# EAGLE design fdcanusb (EAGLE 6.5.0)
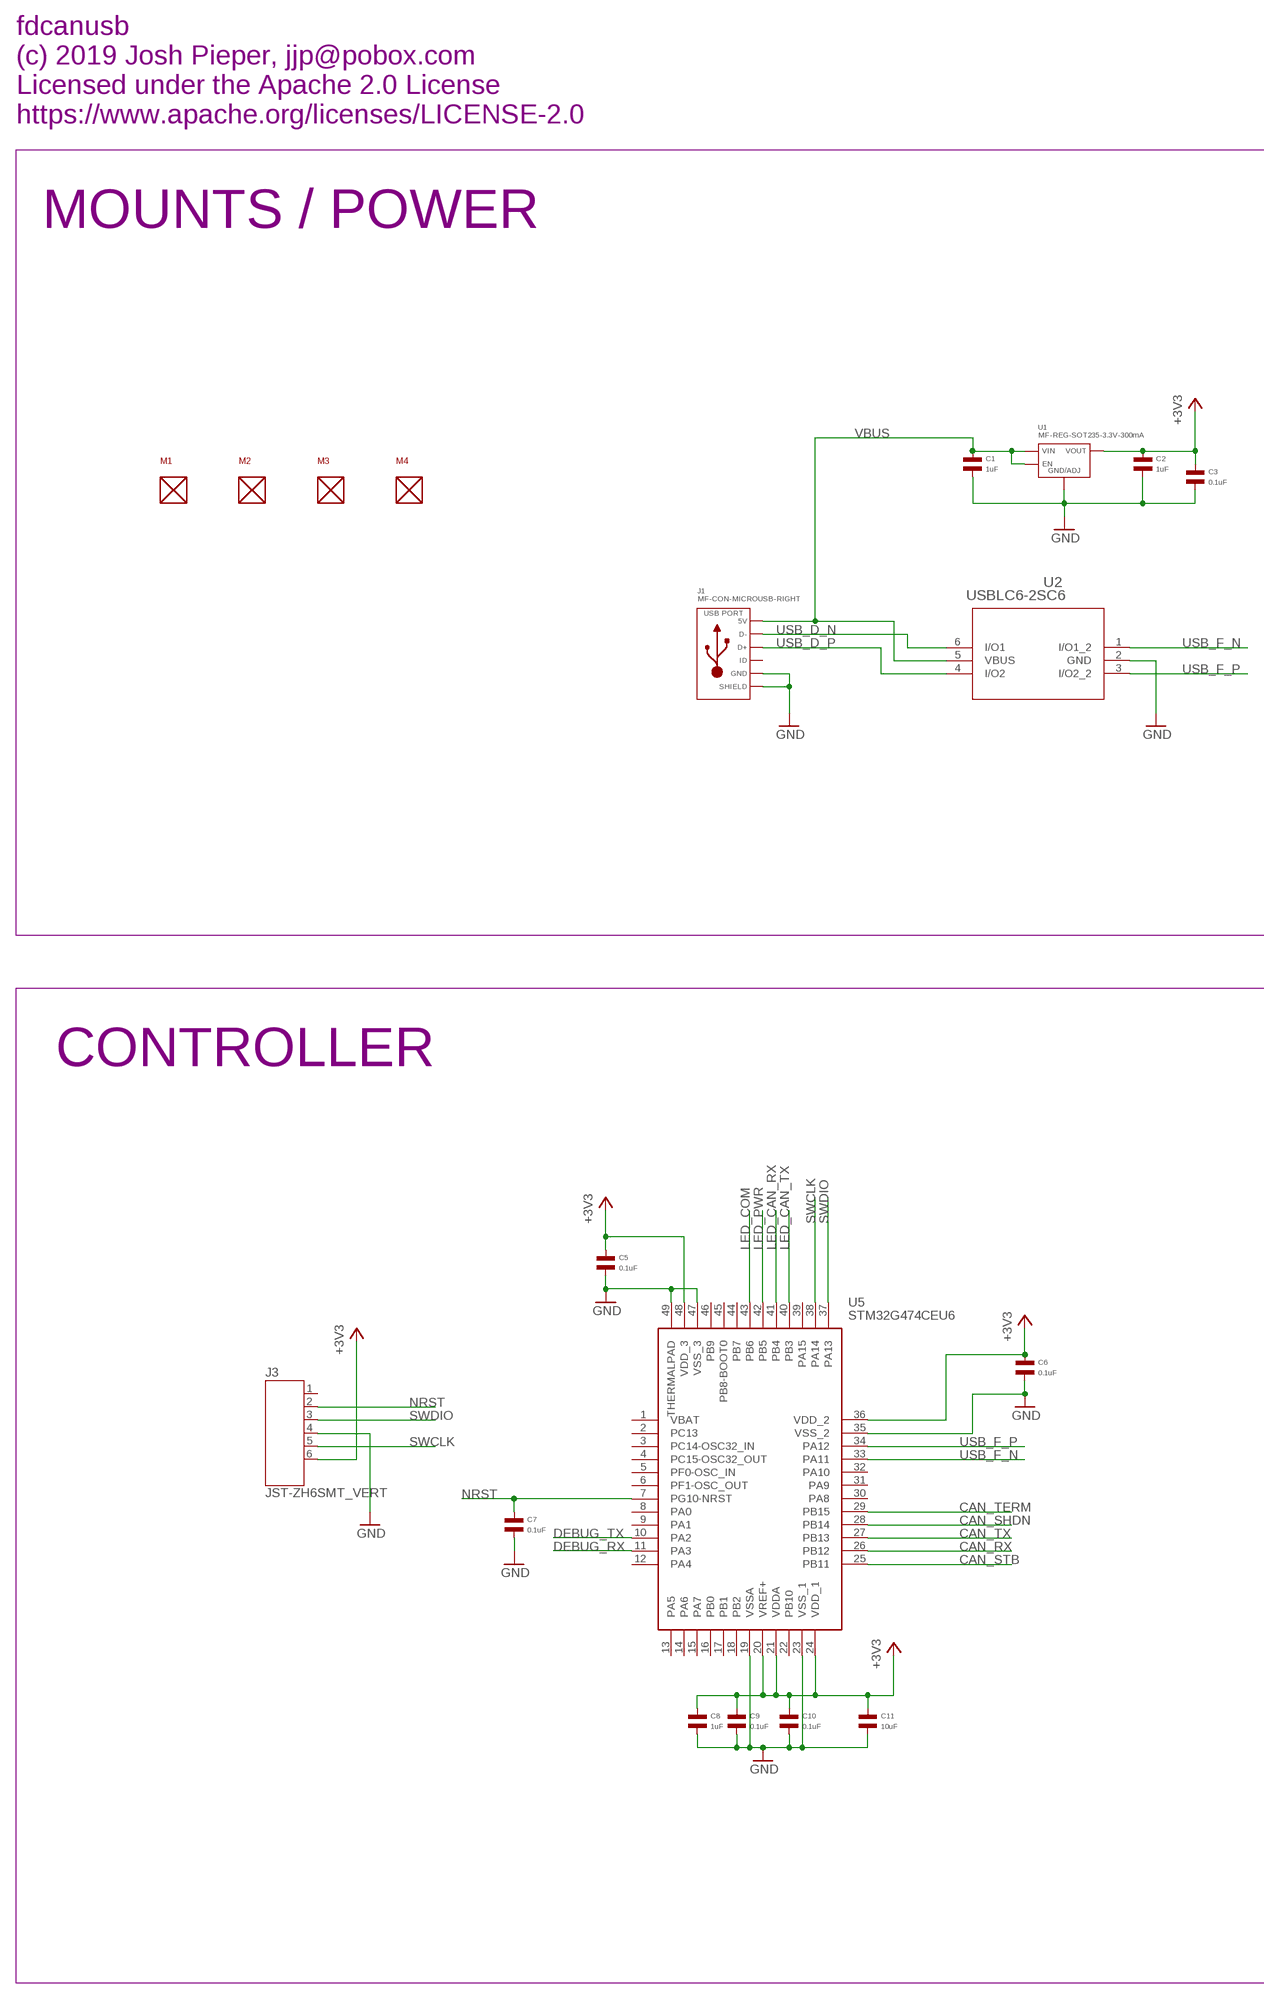
[diagram p0: schematic, sheet 1, part 1 of 2]
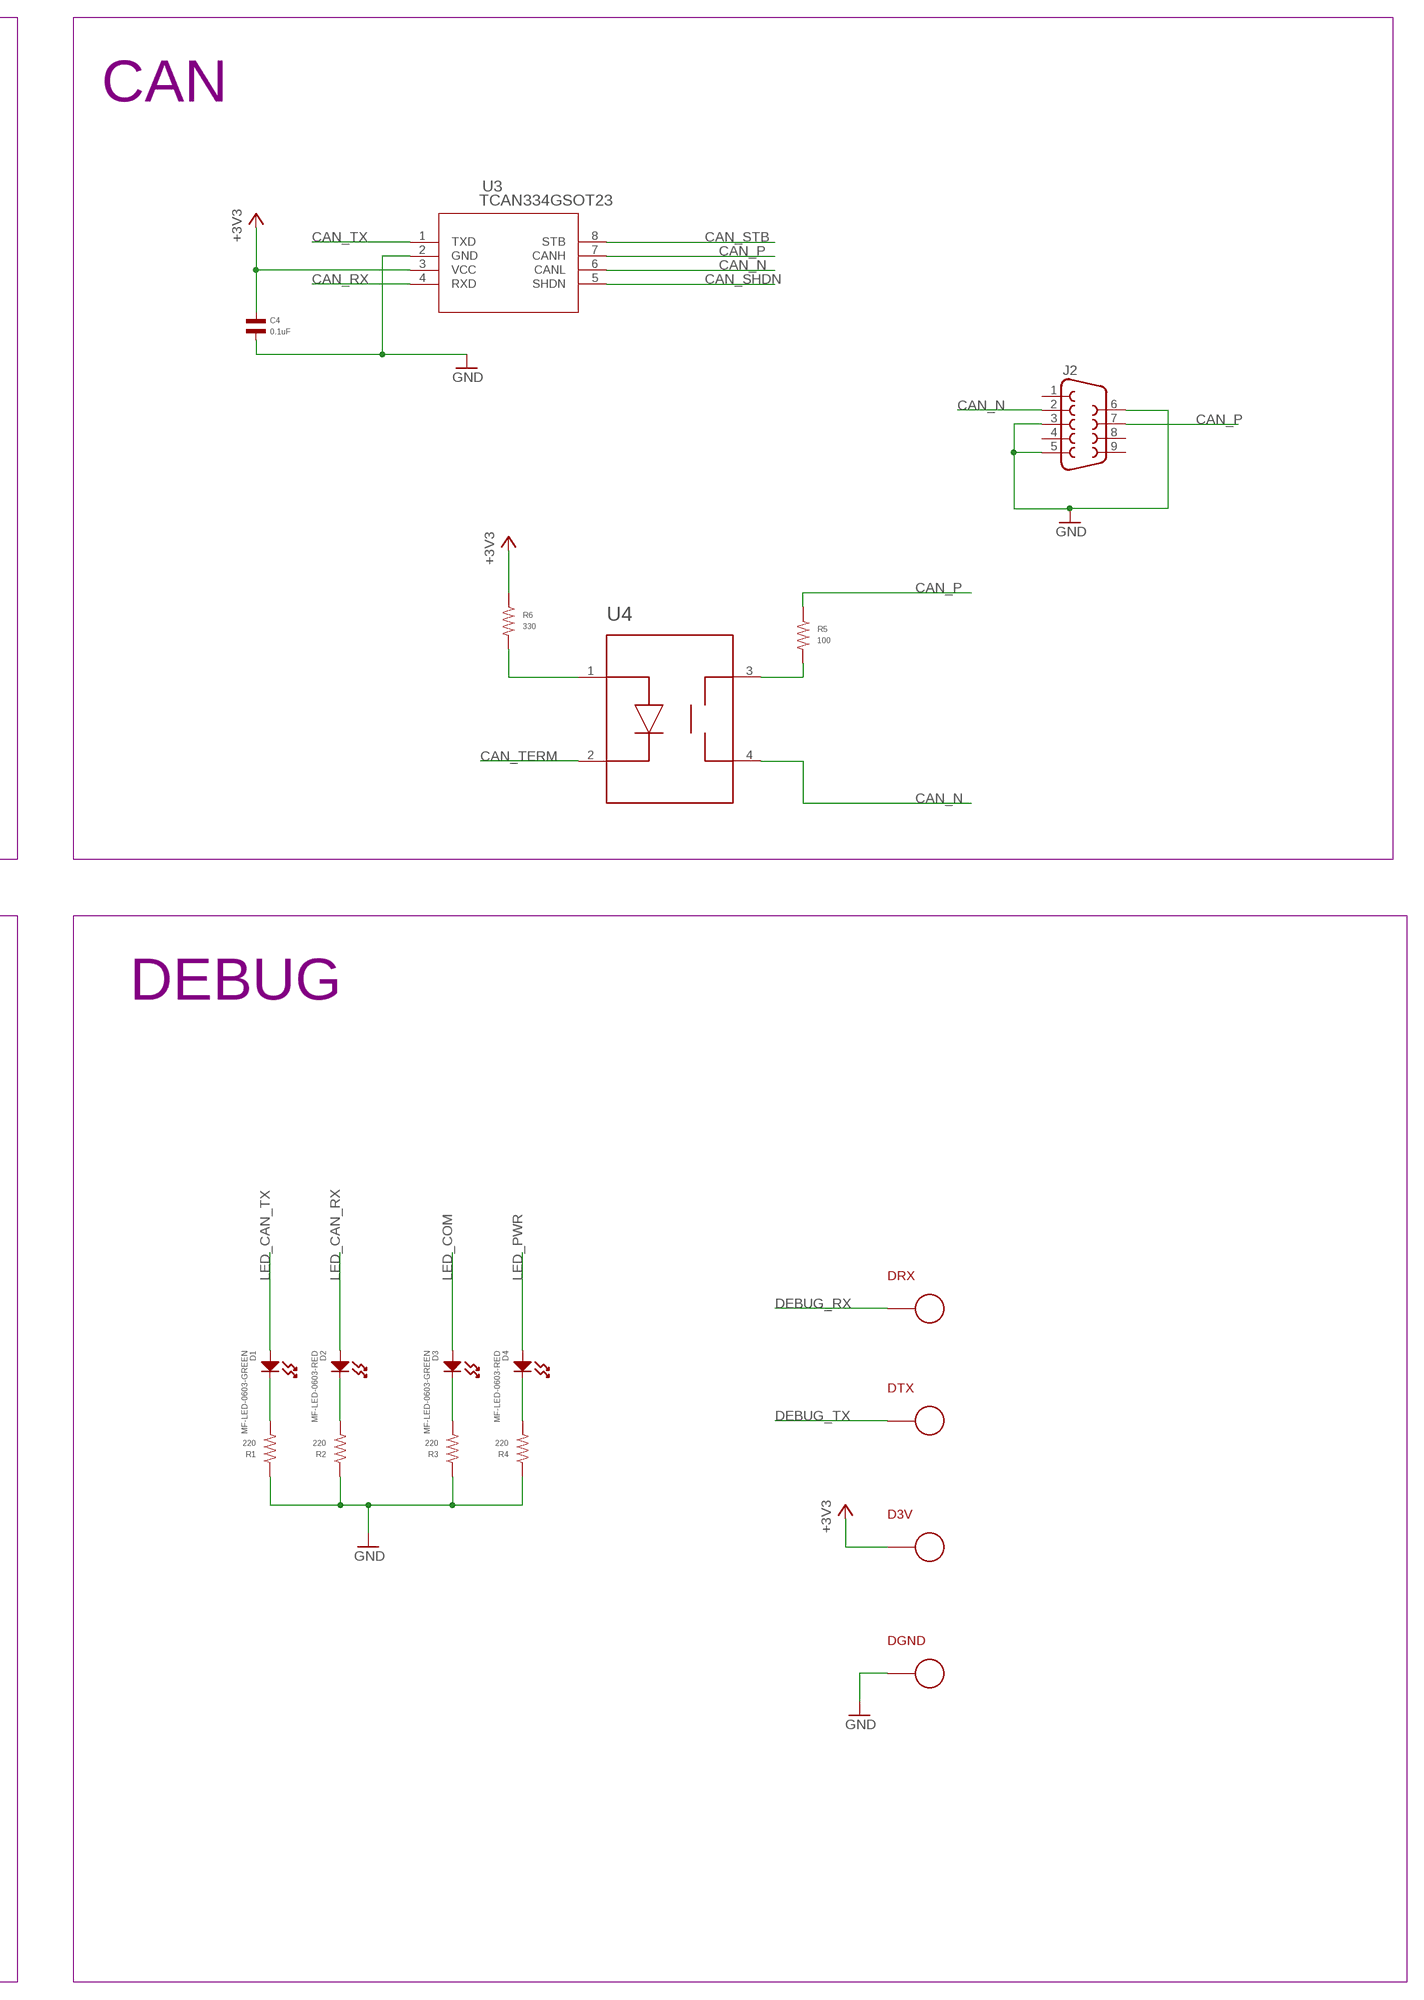
[diagram p1: schematic, sheet 1, part 2 of 2]

## Parts
C1  1uF  CAPACITOR_NP_0603  [C0603]
C2  1uF  CAPACITOR_NP_0603  [C0603]
C3  0.1uF  CAPACITOR_NP_0402  [C0402]
C4  0.1uF  CAPACITOR_NP_0402  [C0402]
C5  0.1uF  CAPACITOR_NP_0402  [C0402]
C6  0.1uF  CAPACITOR_NP_0402  [C0402]
C7  0.1uF  CAPACITOR_NP_0402  [C0402]
C8  1uF  CAPACITOR_NP_0603  [C0603]
C9  0.1uF  CAPACITOR_NP_0402  [C0402]
C10  0.1uF  CAPACITOR_NP_0402  [C0402]
C11  10uF  CAPACITOR_NP_1206  [C1206]
D1  MF-LED-0603-GREEN  LED_SINGLE-0603-GREEN  [LED0603]
D2  MF-LED-0603-RED  LED_SINGLE-0603-RED  [LED0603]
D3  MF-LED-0603-GREEN  LED_SINGLE-0603-GREEN  [LED0603]
D3V  PAD24AWG_PAD  [24AWG_PAD]
D4  MF-LED-0603-RED  LED_SINGLE-0603-RED  [LED0603]
DGND  PAD24AWG_PAD  [24AWG_PAD]
DRX  PAD24AWG_PAD  [24AWG_PAD]
DTX  PAD24AWG_PAD  [24AWG_PAD]
J1  MF-CON-MICROUSB-RIGHT  USB_MICRO_RIGHT  [MICROUSB-RIGHT]
J2  F09H  [F09H]
J3  JST-ZH6SMT_VERT  [JST_B6B-ZR-SM4-TF(LF)(SN)]
M1  MOUNT  [M2.5MOUNT]
M2  MOUNT  [M2.5MOUNT]
M3  MOUNT  [M2.5MOUNT]
M4  MOUNT  [M2.5MOUNT]
R1  220  RESISTOR_0402  [R0402]
R2  220  RESISTOR_0402  [R0402]
R3  220  RESISTOR_0402  [R0402]
R4  220  RESISTOR_0402  [R0402]
R5  100  RESISTOR_0805  [R0805]
R6  330  RESISTOR_0402  [R0402]
U1  MF-REG-SOT235-3.3V-300mA  TLV70233PDBVR  [SOT-23-5]
U2  USBLC6-2SC6  [SOT23-6L]
U3  TCAN334GSOT23  [SOT23-8]
U4  TLP3317  [TLP3317]
U5  STM32G474CEU6  [QFN50P700X700X60-49N]

## Nets
+3V3: C2.P$1 C3.P$1 C4.P$1 C5.P$1 C6.P$1 C8.P$1 C9.P$1 C10.P$1 C11.P$1 D3V.P$1 J3.6 R6.P$1 U1.P$5(VOUT) U3.3(VCC) U5.20(VREF+) U5.21(VDDA) U5.24(VDD_1) U5.36(VDD_2) U5.48(VDD_3)
CAN_N [can]: J2.2 U3.6(CANL) U4.4(SW2)
CAN_P [can]: J2.7 R5.P$1 U3.7(CANH)
CAN_RX: U3.4(RXD) U5.26(PB12)
CAN_SHDN: U3.5(SHDN) U5.28(PB14)
CAN_STB: U3.8(STB) U5.25(PB11)
CAN_TERM: U4.2(CATHODE) U5.29(PB15)
CAN_TX: U3.1(TXD) U5.27(PB13)
DEBUG_RX: DRX.P$1 U5.11(PA3)
DEBUG_TX: DTX.P$1 U5.10(PA2)
GND: C1.P$2 C2.P$2 C3.P$2 C4.P$2 C5.P$2 C6.P$2 C7.P$2 C8.P$2 C9.P$2 C10.P$2 C11.P$2 DGND.P$1 J1.5(GND) J1.S1(SLD) J1.S2(SLD) J1.S3(SLD) J1.S4(SLD) J1.S5(SLD) J1.S6(SLD) J2.3 J2.5 J2.6 J3.4 R1.P$1 R2.P$1 R3.P$1 R4.P$1 U1.P$2(GND/ADJ) U2.2(GND) U3.2(GND) U5.19(VSSA) U5.23(VSS_1) U5.35(VSS_2) U5.47(VSS_3) U5.49(THERMALPAD)
LED_CAN_RX: D2.ANODE U5.41(PB4)
LED_CAN_TX: D1.ANODE U5.40(PB3)
LED_COM: D3.ANODE U5.43(PB6)
LED_PWR: D4.ANODE U5.42(PB5)
N$3: D1.CATHODE R1.P$2
N$4: D2.CATHODE R2.P$2
N$5: D3.CATHODE R3.P$2
N$6: D4.CATHODE R4.P$2
N$7: R5.P$2 U4.3(SW1)
N$8: R6.P$2 U4.1(ANODE)
NRST: C7.P$1 J3.2 U5.7(PG10-NRST)
SWCLK: J3.5 U5.38(PA14)
SWDIO: J3.3 U5.37(PA13)
USB_D_N [usb]: J1.2(D-) U2.6(I/O1)
USB_D_P [usb]: J1.3(D+) U2.4(I/O2)
USB_F_N [usb]: U2.1(I/O1_2) U5.33(PA11)
USB_F_P [usb]: U2.3(I/O2_2) U5.34(PA12)
VBUS: C1.P$1 J1.1(5V) U1.P$1(VIN) U1.P$3(EN) U2.5(VBUS)
Unconnected: J1.4(ID) J2.1 J2.4 J2.8 J2.9 J3.1 U5.1(VBAT) U5.2(PC13) U5.3(PC14-OSC32_IN) U5.4(PC15-OSC32_OUT) U5.5(PF0-OSC_IN) U5.6(PF1-OSC_OUT) U5.8(PA0) U5.9(PA1) U5.12(PA4) U5.13(PA5) U5.14(PA6) U5.15(PA7) U5.16(PB0) U5.17(PB1) U5.18(PB2) U5.22(PB10) U5.30(PA8) U5.31(PA9) U5.32(PA10) U5.39(PA15) U5.44(PB7) U5.45(PB8-BOOT0) U5.46(PB9)

## Notes on the sheet
- fdcanusb
  (c) 2019 Josh Pieper, jjp@pobox.com
  Licensed under the Apache 2.0 License
  https://www.apache.org/licenses/LICENSE-2.0
- MOUNTS / POWER | CAN
- CONTROLLER | DEBUG

## Library data of the parts
C1 C2 C8 = mfpassives:CAPACITOR_NP: Library: MF_Passives Description: Device for Non-Polarized Capacitors. Manufacture part number (MPN) can be added via Attributes. Check https://factory.macrofab.com/parts for the house parts list.; HOUSEPART: YES; MPN: MF-CAP-0603-1uF; POPULATE: 1
C3-C7 C9 C10 = mfpassives:CAPACITOR_NP: Library: MF_Passives Description: Device for Non-Polarized Capacitors. Manufacture part number (MPN) can be added via Attributes. Check https://factory.macrofab.com/parts for the house parts list.; HOUSEPART: YES; MPN: MF-CAP-0402-0.1uF; POPULATE: 1
C11 = mfpassives:CAPACITOR_NP: Library: MF_Passives Description: Device for Non-Polarized Capacitors. Manufacture part number (MPN) can be added via Attributes. Check https://factory.macrofab.com/parts for the house parts list.; HOUSEPART: YES; MPN: MF-CAP-1206-10uF; POPULATE: 1
D1 D3 = mfleds:LED_SINGLE: Library: MF_LEDs Description: Device for Single LED Packages. Manufacture part number (MFG#) can be added via Attributes.; HOUSEPART: YES; MPN: MF-LED-0603-GREEN; POPULATE: 1; URL: https://factory.macrofab.com/part/MF-LED-0603-GREEN
D2 D4 = mfleds:LED_SINGLE: Library: MF_LEDs Description: Device for Single LED Packages. Manufacture part number (MFG#) can be added via Attributes.; HOUSEPART: YES; MPN: MF-LED-0603-RED; POPULATE: 1; URL: https://factory.macrofab.com/part/MF-LED-0603-RED
D3V DGND DRX DTX = fdcanusb:PAD; POPULATE: 0
J1 = mfconnectors:USB: Library: MF_Connectors Description: 5 Pin USB Connectors. SLD is the shield connection. Usually tied to ground through a small ferrite bead.; HOUSEPART: YES; MPN: MF-CON-MICROUSB-RIGHT; POPULATE: 1; URL: https://factory.macrofab.com/part/MF-CON-MICROUSB-RIGHT
J2 = fdcanusb:F09: SUB-D; OC_FARNELL: unknown; OC_NEWARK: unknown; POPULATE: 0
J3 = fdcanusb:JST-ZH6; MF: JST; MPN: B6B-ZR-SM4-TF(LF)(SN); POPULATE: 1
M1-M4 = fdcanusb:MOUNT; POPULATE: 0
R1-R4 = mfpassives:RESISTOR: Library: MF_Passives Description: Device for Resistors. Manufacture part number (MPN), Voltage, Tolerance, and Wattage Rating can be added via Attributes. Check https://factory.macrofab.com/parts for the house parts list.; MPN: MF-RES-0402-220; POPULATE: 1
R5 = mfpassives:RESISTOR: Library: MF_Passives Description: Device for Resistors. Manufacture part number (MPN), Voltage, Tolerance, and Wattage Rating can be added via Attributes. Check https://factory.macrofab.com/parts for the house parts list.; MPN: MF-RES-0805-100; POPULATE: 1
R6 = mfpassives:RESISTOR: Library: MF_Passives Description: Device for Resistors. Manufacture part number (MPN), Voltage, Tolerance, and Wattage Rating can be added via Attributes. Check https://factory.macrofab.com/parts for the house parts list.; MPN: MF-RES-0402-330; POPULATE: 1
U1 = mficpower:TLV702: Manufacturer Part #: TLV702 Manufacturer: Texas Instruments Description: LDO Voltage Regulators; HOUSEPART: YES; MPN: MF-REG-SOT235-3.3V-300mA; POPULATE: 1; URL: https://factory.macrofab.com/part/MF-REG-SOT235-3.3V-300mA
U2 = fdcanusb:USBLC6-2SC6; MANUFACTURER_PART_NUMBER: USBLC62SC6; MF: ST; MPN: USBLC6-2SC6; POPULATE: 1; VENDOR: STMicroelectronics
U3 = fdcanusb:TCAN334G; MF: TI; MPN: TCAN334GDCNT; POPULATE: 1
U4 = fdcanusb:TLP3317; MF: TOSHIBA; MPN: TLP3317; POPULATE: 1
U5 = fdcanusb:STM32G474CEU6: STMICROELECTRONICS - STM32G474CEU6 - MCU, 32BIT, 170MHZ, UFQFPN-48 Source: Datasheet <https://componentsearchengine.com/Datasheets/1/STM32G474CEU6.pdf>; DESCRIPTION: STMICROELECTRONICS - STM32G474CEU6 - MCU, 32BIT, 170MHZ, UFQFPN-48; HEIGHT: 0.6mm; MANUFACTURER_NAME: STMicroelectronics; MANUFACTURER_PART_NUMBER: STM32G474CEU6; MF: ST; MOUSER_PART_NUMBER: 511-STM32G474CEU6; MOUSER_PRICE-STOCK: https://www.mouser.com/Search/Refine.aspx?Keyword=511-STM32G474CEU6; MPN: STM32G474CEU6; POPULATE: 1

## Net classes
1 usb: width 0.305 mm, clearance 0.127 mm
2 can: width 0.216 mm, clearance 0.127 mm

## Board
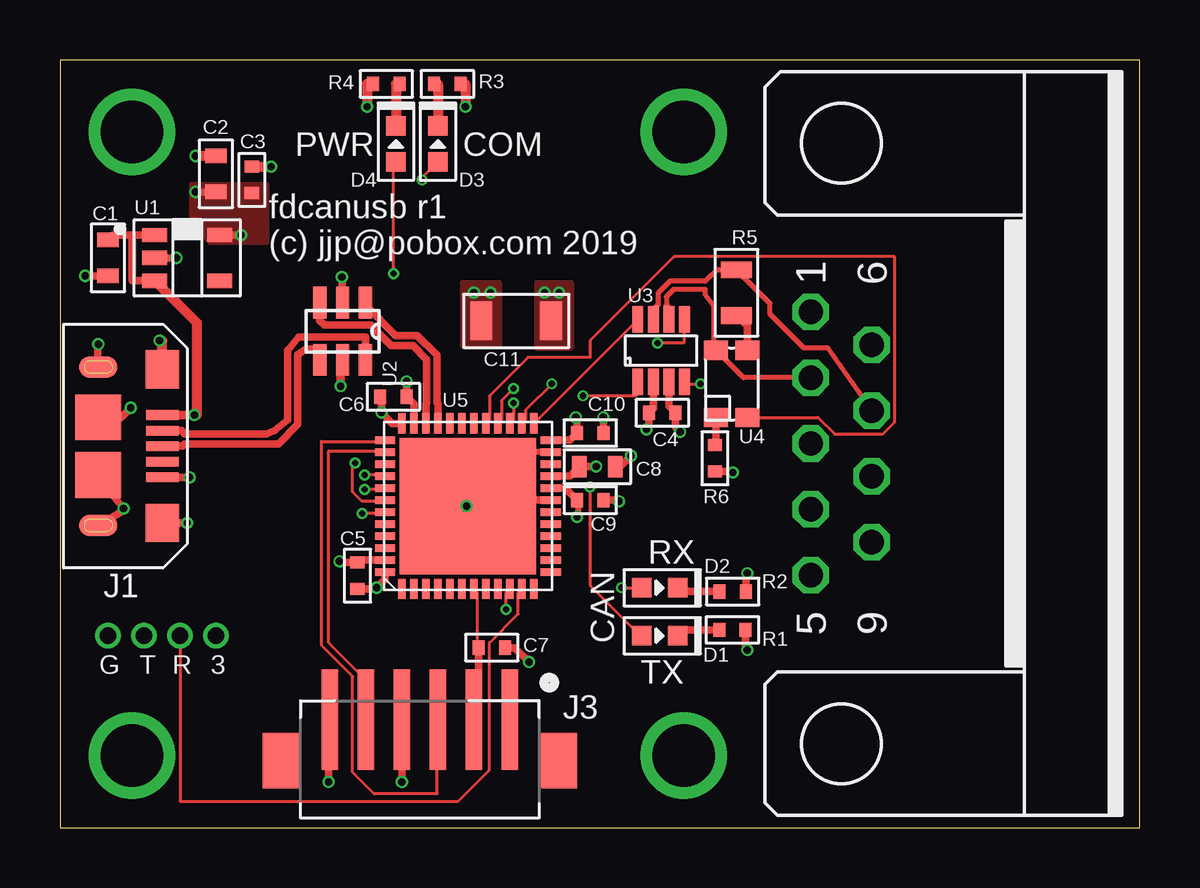
[diagram p2: board, top side]
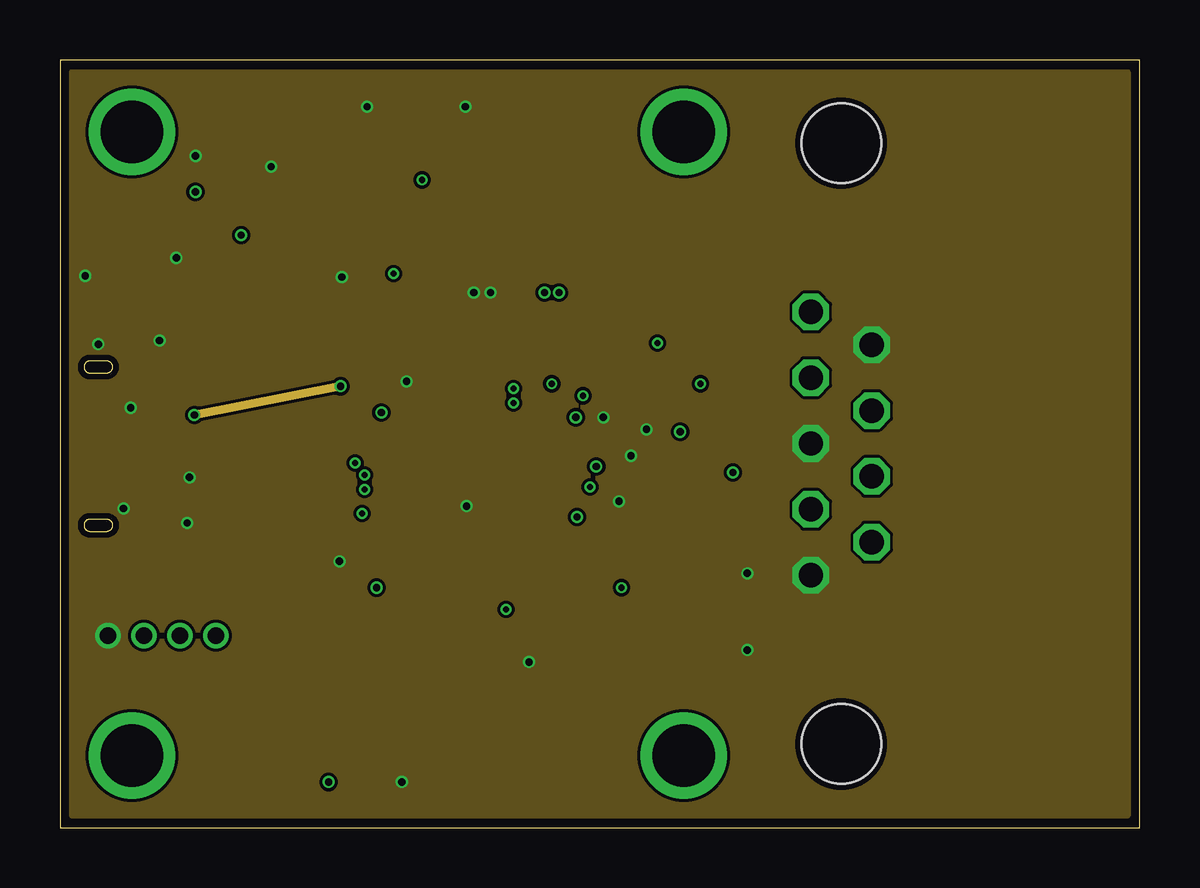
[diagram p3: board, inner layer Route2]
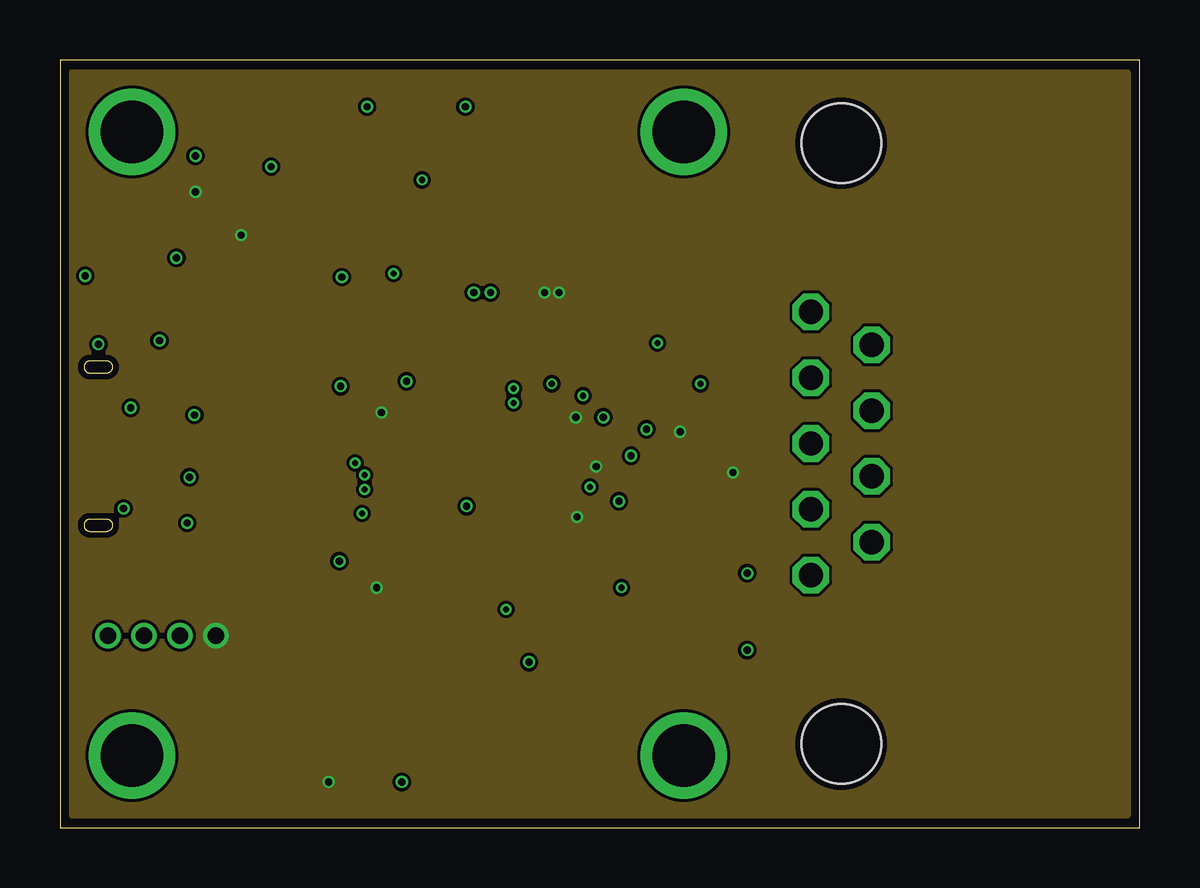
[diagram p4: board, inner layer Route15]
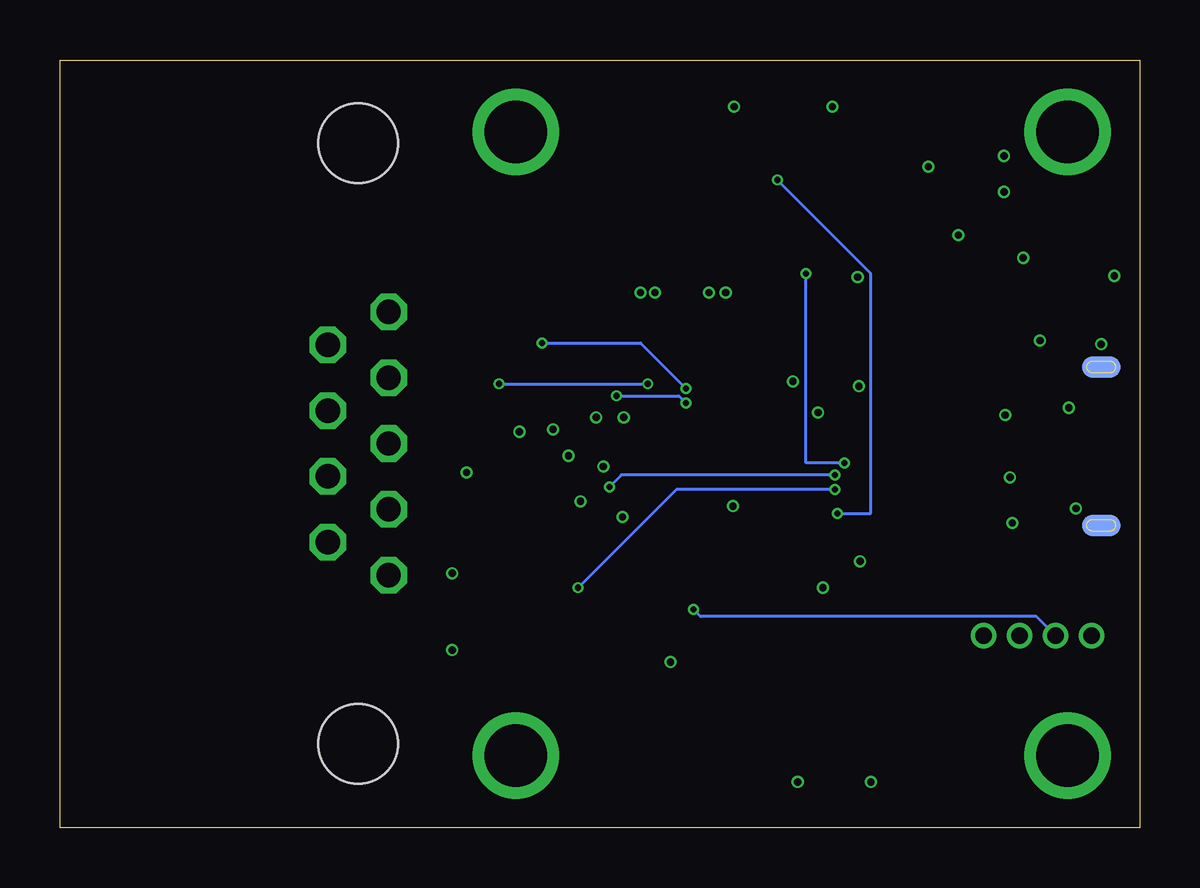
[diagram p5: board, bottom side, seen from below]

Size 45 x 32 mm. Coordinates in mm from the lower left corner, seen from the top.
Outline: 0,0 45,0 45,32 0,32 0,0
Copper layers (1*2*15*16): Top 0.035mm / dielectric 0.23mm / Route2 0.035mm / dielectric 0.93mm / Route15 0.035mm / dielectric 0.23mm / Bottom 0.035mm
Design rules "MF_Standard_4_Layer": minimum track width 5mil, minimum drill 10mil, track to track 5mil, track to pad 5mil, pad to pad 5mil, via to via 5mil, smd to smd 0mil, copper to edge 10mil, drill to drill 10mil, minimum pad ring 4mil, minimum via ring 4mil, stop-mask expansion 2mil, vias tented up to drill 25mil, thermal gap 10mil

### Footprints (pad centres in the part's own frame; a part is rotated, then mirrored left to right if it is on the bottom)
C0603 = smd 0.6 x 0.9: P$1 -0.75,0; P$2 0.75,0
C0402 = smd 0.5 x 0.6: P$1 -0.55,0; P$2 0.55,0
C1206 = smd 0.9 x 1.6: P$1 -1.45,0; P$2 1.45,0
LED0603 = smd 0.8 x 0.8: ANODE 0.75,0; CATHODE -0.75,0
24AWG_PAD = drill 0.7: P$1 0,0
MICROUSB-RIGHT = smd 0.4 x 1.35: 1 -1.3,1.27; 2 -0.65,1.27; 3 0,1.27; 4 0.65,1.27; 5 1.3,1.27 | smd 0.9 x 1.6: S1 -3.3,-1.4; S2 3.3,-1.4 | smd 1.6 x 1.4: S3 -3.2,1.27; S4 3.2,1.27 | smd 1.9 x 1.9: S5 -1.2,-1.405; S6 1.2,-1.405 | smd 0.9 x 1.6 bottom: S7 -3.3,-1.4; S8 3.3,-1.4
F09H = drill 1.016 octagon: 1 -5.486,-1.27; 2 -2.743,-1.27; 3 0,-1.27; 4 2.743,-1.27; 5 5.486,-1.27; 6 -4.115,1.27; 7 -1.372,1.27; 8 1.372,1.27; 9 4.115,1.27 | hole 3.302: -12.522,0; 12.522,0
JST_B6B-ZR-SM4-TF(LF)(SN) = smd 0.7 x 4.2: 1 -3.75,-2; 2 -2.25,-2; 3 -0.75,-2; 4 0.75,-2; 5 2.25,-2; 6 3.75,-2 | smd 1.5 x 2.3: P1 -5.8,-0.29; P2 5.8,-0.29
M2.5MOUNT = drill 2.6: P$1 0,0
R0402 = smd 0.5 x 0.6: P$1 -0.55,0; P$2 0.55,0
R0805 = smd 0.7 x 1.3: P$1 -0.95,0; P$2 0.95,0
SOT-23-5 = smd 1.05 x 0.6: P$1 -1.35,0.95; P$2 -1.35,0; P$3 -1.35,-0.95; P$4 1.35,-0.95; P$5 1.35,0.95
SOT23-6L = smd 1.321 x 0.559: 1 -1.194,0.95; 2 -1.194,0; 3 -1.194,-0.95; 4 1.194,-0.95; 5 1.194,0; 6 1.194,0.95
SOT23-8 = smd 0.45 x 1.1: 1 -0.975,-1.3; 2 -0.325,-1.3; 3 0.325,-1.3; 4 0.975,-1.3; 5 0.975,1.3; 6 0.325,1.3; 7 -0.325,1.3; 8 -0.975,1.3
TLP3317 = smd 1 x 0.8: 1 -0.65,-1.4; 2 0.65,-1.4; 3 0.65,1.4; 4 -0.65,1.4
QFN50P700X700X60-49N = smd 0.85 x 0.3: 1 -3.45,2.75; 2 -3.45,2.25; 3 -3.45,1.75; 4 -3.45,1.25; 5 -3.45,0.75; 6 -3.45,0.25; 7 -3.45,-0.25; 8 -3.45,-0.75; 9 -3.45,-1.25; 10 -3.45,-1.75; 11 -3.45,-2.25; 12 -3.45,-2.75; 25 3.45,-2.75; 26 3.45,-2.25; 27 3.45,-1.75; 28 3.45,-1.25; 29 3.45,-0.75; 30 3.45,-0.25; 31 3.45,0.25; 32 3.45,0.75; 33 3.45,1.25; 34 3.45,1.75; 35 3.45,2.25; 36 3.45,2.75 | smd 0.3 x 0.85: 13 -2.75,-3.45; 14 -2.25,-3.45; 15 -1.75,-3.45; 16 -1.25,-3.45; 17 -0.75,-3.45; 18 -0.25,-3.45; 19 0.25,-3.45; 20 0.75,-3.45; 21 1.25,-3.45; 22 1.75,-3.45; 23 2.25,-3.45; 24 2.75,-3.45; 37 2.75,3.45; 38 2.25,3.45; 39 1.75,3.45; 40 1.25,3.45; 41 0.75,3.45; 42 0.25,3.45; 43 -0.25,3.45; 44 -0.75,3.45; 45 -1.25,3.45; 46 -1.75,3.45; 47 -2.25,3.45; 48 -2.75,3.45 | smd 5.7 x 5.7: 49 0,0

### Placement (x,y rotation side)
C1  2,23.75 270 top
C2  6.5,27.25 90 top
C3  8,27 90 top
C4  25.11,17.29 180 top
C5  12.4,10.5 90 top
C6  13.9,17.96 0 top
C7  18,7.5 0 top
C8  22.4,15.05 0 top
C9  22.1,13.65 0 top
C10  22.1,16.45 0 top
C11  19.02,21.12 180 top
D1  25,8 180 top
D2  25,10 180 top
D3  15.75,28.5 270 top
D3V  6.5,8 0 top
D4  14,28.5 270 top
DGND  2,8 0 top
DRX  5,8 0 top
DTX  3.5,8 0 top
J1  3,15.9 270 top
J2  32.57,16.01 270 top
J3  15,2.5 180 top
M1  26,3 0 top
M2  26,29 0 top
M3  3,3 0 top
M4  3,29 0 top
R1  28.03,8.24 180 top
R2  28.04,9.84 180 top
R3  16.15,31 180 top
R4  13.6,31 0 top
R5  28.2,22.3 270 top
R6  27.3,15.4 90 top
U1  5.3,23.75 0 top
U2  11.78,20.69 270 top
U3  25.06,19.88 0 top
U4  28,18.5 0 top
U5  17,13.4 90 top

### Tracks (layer width: path | path; a pad name or v marks a point on that pad's centre or on a via)
+3V3  (via drill 0.3)
  Top 0.254: 21.05,14.15 21.6,13.6 21.6,13 v21.55,12.95
  Top 0.305: U1.P$5 v7.55,24.7 | 6.5,26.45 C2.P$1 v5.65,26.5 | U5.48 13.55,10.35 v13.2,10 13.15,9.95 C5.P$1 | U5.36 13.85,16.85 v13.4,17.3 13.4,17.91 C6.P$1 | J3.6 11.2,4.45 v11.2,1.9 | U5.24 21.25,16.15 C10.P$1 21.55,17.05 v21.5,17.1 | U5.21 21.25,14.65 C8.P$1 v22.35,15.05 | U5.20 21.05,14.15 C9.P$1 | U3.3 25.39,17.57 C4.P$1 25.66,16.69 v25.85,16.5 | R6.P$1 28,14.85 v28.05,14.8
  other vias: 20.2,22.3 20.8,22.3
  pour Route15 (no thermals): 0.5,31.5 44.5,31.5 44.5,0.5 0.5,0.5
  pour Top (no thermals): 5.5,26.8 8.6,26.8 8.6,24.4 6.3,24.4 5.5,25.2
  pour Top (no thermals): 19.9,22.7 21.3,22.7 21.3,20 19.9,20
CAN_N
  Top 0.216: J2.2 28.5,18.75 U4.4 27.25,19.9 27.25,21.75 26.9,22.2 26.9,22.43 25.57,22.43 25.27,22.13 25.27,21.8 25.39,21.69 U3.6
CAN_P
  Top 0.216: J2.7 32,20 31,20 29.6,21.4 29.6,21.85 R5.P$1 27.38,23.25 26.9,22.77 25.43,22.77 24.93,22.27 24.93,21.8 24.73,21.61 U3.7
CAN_RX  (via drill 0.25)
  Top 0.127: U5.26 19.4,17 19.4,17.4 v20.5,18.5 | v26.7,18.5 26.1,18.5 U3.4
  Bottom 0.127: v26.7,18.5 v20.5,18.5
CAN_SHDN  (via drill 0.25)
  Top 0.127: U5.28 18.4,17 18.4,17.8 v18.9,18.3 | v24.9,20.2 26,20.2 26,21.1 U3.5
  Bottom 0.127: v18.9,18.3 20.8,20.2 v24.9,20.2
CAN_STB
  Top 0.127: U5.25 24,21.1 U3.8
CAN_TERM
  Top 0.127: U5.29 17.9,17 17.9,18 19.5,19.6 22.1,19.6 22.1,20.3 25.6,23.8 34.8,23.8 34.8,16.9 34.3,16.4 32.3,16.4 31.6,17.1 U4.2
CAN_TX  (via drill 0.25)
  Top 0.127: U5.27 18.9,17 v18.9,17.7 | v21.8,18 24,18 24,18.5 U3.1
  Bottom 0.127: v18.9,17.7 19.2,18 v21.8,18
DEBUG_RX
  Top 0.127: U5.11 19.1,9.8 19.1,8.9 17.9,7.7 17.9,2.4 16.6,1.1 5,1.1 DRX.P$1
DEBUG_TX  (via drill 0.25)
  Top 0.127: U5.10 18.6,9.8 v18.6,9.1
  Bottom 0.127: v18.6,9.1 18.3,8.8 4.3,8.8 DTX.P$1
GND  (via drill 0.3)
  Top 0.127: U5.49 v16.95,13.4
  Top 0.254: U5.23 19.25,15.65 arc90 U5.49
  Top 0.305: J1.5 v5.4,14.6 | J1.S1 1.57,19.98 v1.6,20.15 | C1.P$2 v1.05,23 | U1.P$2 v4.85,23.75 | U5.47 12.5,11.15 C5.P$2 11.7,11.05 v11.65,11.1 | U5.35 14.75,17.66 C6.P$2 v14.45,18.6 | J3.4 v14.25,1.9 | C7.P$2 18.95,7.5 v19.55,6.9 | R2.P$1 28.59,10.54 v28.65,10.6 | R1.P$1 28.58,7.47 v28.65,7.4 | C8.P$2 23.35,15.05 v23.8,15.5 | C9.P$2 23.25,13.65 v23.3,13.6 | U5.19 17.25,13.65 U5.49 | U3.2 24.73,17.46 C4.P$2 24.56,16.71 v24.45,16.6 | C10.P$2 v22.65,17.1 | U2.2 11.75,21.91 v11.75,22.95 | v2.95,17.5 2.55,17.1 J1.S5 | J1.S2 2.7,13.25 v2.65,13.3 2.4,13.64 J1.S6 | v5.3,12.7 J1.S4
  Top 0.406: C2.P$2 v5.65,28 | C3.P$2 v8.8,27.55 | R4.P$1 12.8,31 v12.8,30.05 | R3.P$1 16.9,31 v16.9,30.05 | J1.S3 4.27,20.3 v4.15,20.3
  other vias: 17.95,22.3 17.25,22.3
  pour Route2 (no thermals): 0.5,31.5 44.5,31.5 44.5,0.5 0.5,0.5
  pour Top (no thermals): 16.8,22.7 18.3,22.7 18.3,20.1 16.8,20.1
LED_CAN_RX  (via drill 0.25)
  Top 0.127: v23.4,10 D2.ANODE | v12.7,14.1 13.5,14.1 U5.41
  Bottom 0.127: v23.4,10 19.3,14.1 v12.7,14.1
LED_CAN_TX  (via drill 0.25)
  Top 0.127: v22.1,14.2 22.1,10.1 24.2,8 D1.ANODE | v12.7,14.7 13.5,14.7 U5.40
  Bottom 0.127: v22.1,14.2 21.6,14.7 v12.7,14.7
LED_COM  (via drill 0.25)
  Top 0.127: D3.ANODE 15.1,27.1 v15.1,27 | v12.6,13.1 13.5,13.1 U5.43
  Bottom 0.127: v15.1,27 11.2,23.1 11.2,13.1 v12.6,13.1
LED_PWR  (via drill 0.25)
  Top 0.127: v13.9,23.1 13.9,27.6 14,27.7 D4.ANODE | v12.3,15.2 12.2,15.1 12.2,14 12.6,13.6 13.5,13.6 U5.42
  Bottom 0.127: v13.9,23.1 13.9,15.2 v12.3,15.2
N$3
  Top 0.305: R1.P$2 25.99,8.24 D1.CATHODE
N$4
  Top 0.305: R2.P$2 25.91,9.84 D2.CATHODE
N$5
  Top 0.406: R3.P$2 15.75,31 D3.CATHODE
N$6
  Top 0.406: R4.P$2 14,31 D4.CATHODE
N$7
  Top 0.305: U4.3 28.65,20.9 R5.P$2
N$8
  Top 0.305: U4.1 27.35,16 R6.P$2
NRST
  Top 0.127: U5.7 17.4,9.8 17.4,7.6 C7.P$1
  Top 0.305: J3.2 17.45,4.7 C7.P$1
SWCLK
  Top 0.127: U5.38 13.5,15.7 11.2,15.7 11.2,7.7 12.7,6.2 12.7,4.5 J3.5
SWDIO
  Top 0.127: U5.37 13.5,16.1 10.9,16.1 10.9,7.6 12.2,6.3 12.2,2.3 13.1,1.4 15.7,1.4 15.7,4.5 J3.3
USB_D_N
  Top 0.305: U2.6 12.73,20.45 9.95,20.45 9.48,19.89 9.48,16.99 8.96,16.55 8.61,16.42 5.2,16.42 5.07,16.55 J1.2
USB_D_P
  Top 0.305: U2.4 10.83,19.95 10.25,19.95 9.92,19.71 9.92,16.81 9.11,16 8.9,15.98 5.2,15.98 5.12,15.9 J1.3
USB_F_N
  Top 0.305: U2.1 12.74,21.77 14,20.52 14.89,20.52 15.72,19.69 15.72,17.7 15.75,17.67 U5.33
USB_F_P
  Top 0.305: U2.3 10.83,21.14 11.03,20.94 12.96,20.94 13.2,20.7 13.81,20.08 14.71,20.08 15.28,19.51 15.28,17.7 15.25,17.67 U5.34
VBUS  (via drill 0.3)
  Top 0.305: C1.P$1 2.2,24.7 3,24.7 | 3,24.7 U1.P$1 | U1.P$3 3,22.8 3,24.7
  Top 0.356: J1.1 v5.6,17.2 | U2.5 11.7,19.42 v11.7,18.4
  Top 0.406: U1.P$3 5.7,21.05 5.7,17.2 v5.6,17.2
  Route2 0.356: v5.6,17.2 v11.7,18.4

### Text on the board
tPlace: PWR | COM | fdcanusb r1 / (c) jjp@pobox.com 2019 | RX | CAN | G | T | R | 3 | TX